# EAGLE design PPR_2_MP (EAGLE 6.4)

## Sheet 1 of 10
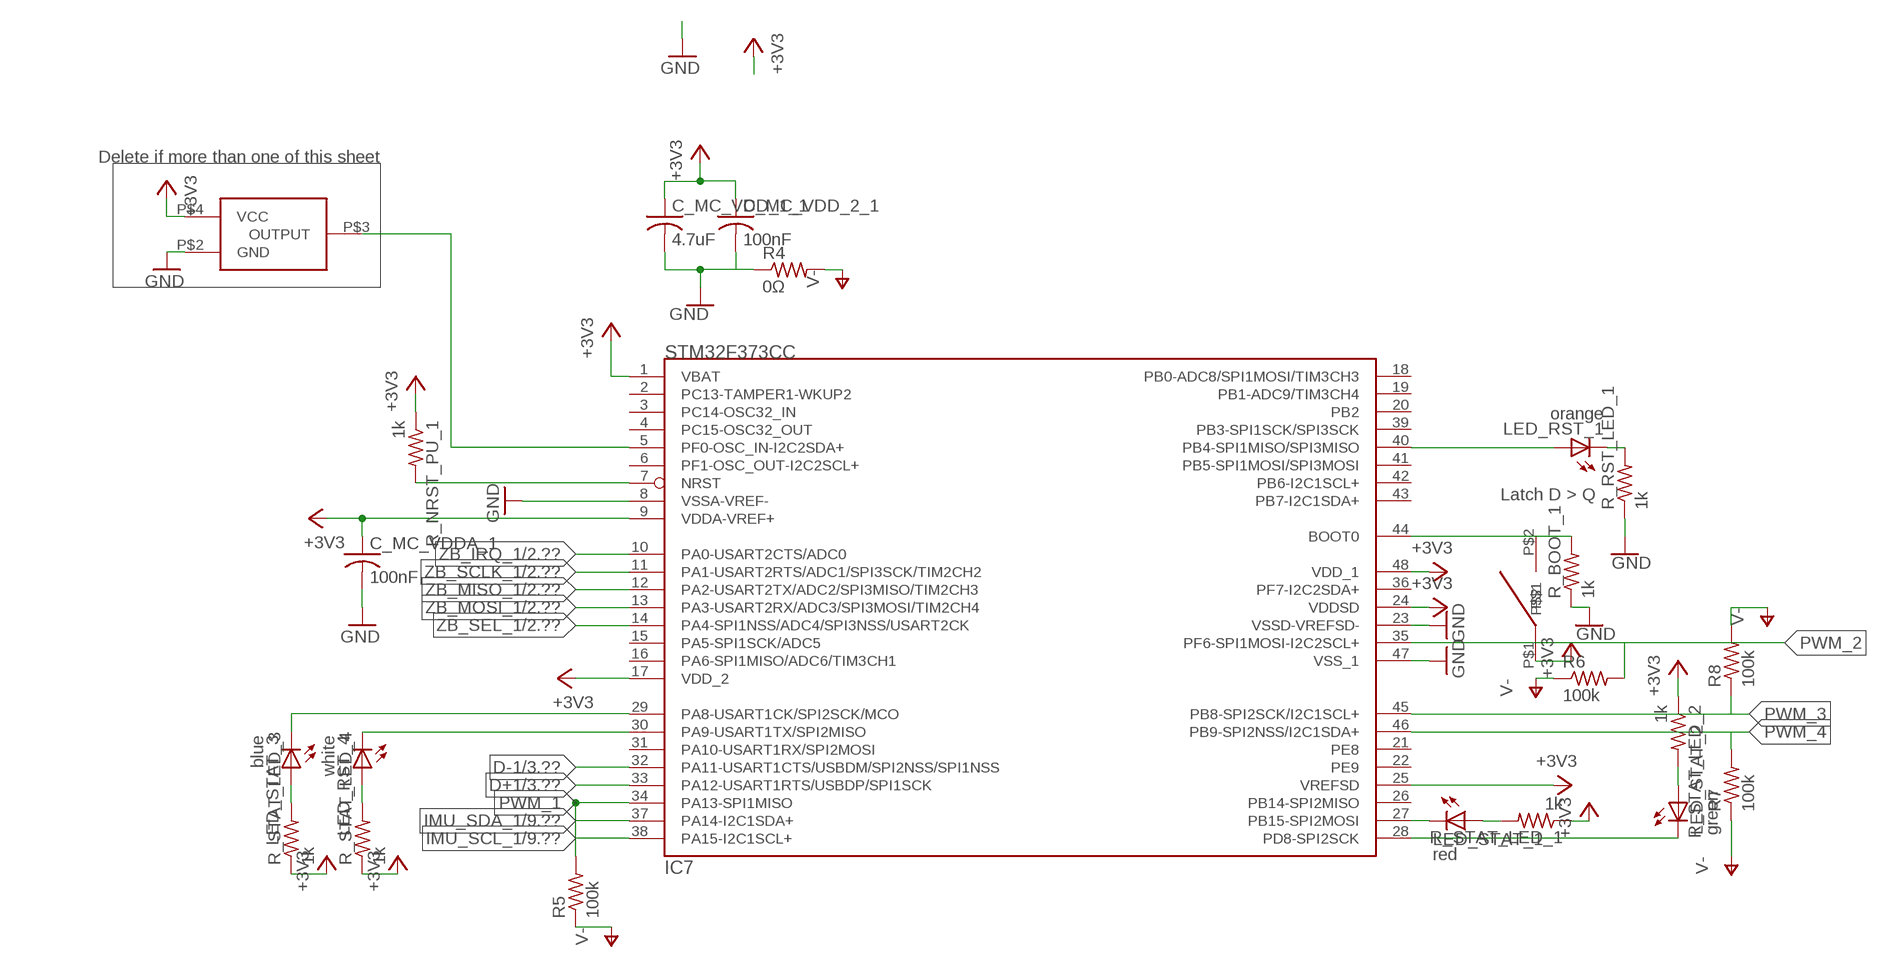
[diagram p0: schematic, sheet 1]

### Parts
C_MC_VDD_1_1  4.7uF  C-USC0603  [C0603]
C_MC_VDD_2_1  100nF  C-USC0603  [C0603]
C_MC_VDDA_1  100nF  C-USC0603  [C0603]
IC7  STM32F373CC  [LQFP48]
LED_RST_1  orange  LEDCHIPLED_0603  [CHIPLED_0603]
LED_RST_4  white  LEDCHIPLED_0603  [CHIPLED_0603]
LED_STAT_1  red  LEDCHIPLED_0603  [CHIPLED_0603]
LED_STAT_2  green  LEDCHIPLED_0603  [CHIPLED_0603]
LED_STAT_3  blue  LEDCHIPLED_0603  [CHIPLED_0603]
OSC1  FOX924B  [4-SMD_5X3.2]
R4  0Ω  R-US_R0603  [R0603]
R5  100k  R-US_R0603  [R0603]
R6  100k  R-US_R0603  [R0603]
R7  100k  R-US_R0603  [R0603]
R8  100k  R-US_R0603  [R0603]
R_BOOT_1  1k  R-US_R0603  [R0603]
R_NRST_PU_1  1k  R-US_R0603  [R0603]
R_RST_LED_1  1k  R-US_R0603  [R0603]
R_STAT_LED_1  1k  R-US_R0603  [R0603]
R_STAT_LED_2  1k  R-US_R0603  [R0603]
R_STAT_LED_3  1k  R-US_R0603  [R0603]
R_STAT_LED_4  1k  R-US_R0603  [R0603]
SW1  B3U  [B3U]

### Nets
16MHZ_3V3: IC7.5(PF0-OSC_IN-I2C2SDA+) OSC1.P$3(OUTPUT) ; also sheet 2
+3V3: C_MC_VDD_1_1.1 C_MC_VDD_2_1.1 C_MC_VDDA_1.1 IC7.1(VBAT) IC7.9(VDDA-VREF+) IC7.17(VDD_2) IC7.24(VDDSD) IC7.25(VREFSD) IC7.48(VDD_1) OSC1.P$4(VCC) R_NRST_PU_1.1 R_STAT_LED_1.1 R_STAT_LED_2.1 R_STAT_LED_3.1 R_STAT_LED_4.1 SW1.P$1 ; also sheet 2,8,9
BOOT0_1: IC7.44(BOOT0) R_BOOT_1.2 SW1.P$2
D+1: IC7.33(PA12-USART1RTS/USBDP/SPI1SCK) ; also sheet 3
D-1: IC7.32(PA11-USART1CTS/USBDM/SPI2NSS/SPI1NSS) ; also sheet 3
GND: C_MC_VDD_1_1.2 C_MC_VDD_2_1.2 C_MC_VDDA_1.2 IC7.8(VSSA-VREF-) IC7.23(VSSD-VREFSD-) IC7.47(VSS_1) OSC1.P$2(GND) R4.1 R_BOOT_1.1 R_RST_LED_1.1 ; also sheet 2,3,8,9,10
IMU_SCL_1: IC7.38(PA15-I2C1SCL+) ; also sheet 9
IMU_SDA_1: IC7.37(PA14-I2C1SDA+) ; also sheet 9
LED_RST_1_1: IC7.40(PB4-SPI1MISO/SPI3MISO) LED_RST_1.A
LED_RST_2_1: LED_RST_1.C R_RST_LED_1.2
N$1: IC7.27(PB15-SPI2MOSI) LED_STAT_1.C
N$2: LED_STAT_1.A R_STAT_LED_1.2
N$3: LED_STAT_2.A R_STAT_LED_2.2
N$4: IC7.28(PD8-SPI2SCK) LED_STAT_2.C
N$5: LED_STAT_3.A R_STAT_LED_3.2
N$6: LED_RST_4.A R_STAT_LED_4.2
N$7: IC7.30(PA9-USART1TX/SPI2MISO) LED_RST_4.C
N$8: IC7.29(PA8-USART1CK/SPI2SCK/MCO) LED_STAT_3.C
NRST_1: IC7.7(NRST) R_NRST_PU_1.2
PWM_1: IC7.34(PA13-SPI1MISO) R5.2 ; also sheet 4
PWM_2: IC7.35(PF6-SPI1MOSI-I2C2SCL+) R6.2 ; also sheet 5
PWM_3: IC7.45(PB8-SPI2SCK/I2C1SCL+) R8.1 ; also sheet 6
PWM_4: IC7.46(PB9-SPI2NSS/I2C1SDA+) R7.2 ; also sheet 7
V-: R4.2 R5.1 R6.1 R7.1 R8.2 ; also sheet 4,5,6,7
ZB_IRQ_1: IC7.10(PA0-USART2CTS/ADC0) ; also sheet 2
ZB_MISO_1: IC7.12(PA2-USART2TX/ADC2/SPI3MISO/TIM2CH3) ; also sheet 2
ZB_MOSI_1: IC7.13(PA3-USART2RX/ADC3/SPI3MOSI/TIM2CH4) ; also sheet 2
ZB_SCLK_1: IC7.11(PA1-USART2RTS/ADC1/SPI3SCK/TIM2CH2) ; also sheet 2
ZB_SEL_1: IC7.14(PA4-SPI1NSS/ADC4/SPI3NSS/USART2CK) ; also sheet 2
Unconnected: IC7.2(PC13-TAMPER1-WKUP2) IC7.3(PC14-OSC32_IN) IC7.4(PC15-OSC32_OUT) IC7.6(PF1-OSC_OUT-I2C2SCL+) IC7.15(PA5-SPI1SCK/ADC5) IC7.16(PA6-SPI1MISO/ADC6/TIM3CH1) IC7.18(PB0-ADC8/SPI1MOSI/TIM3CH3) IC7.19(PB1-ADC9/TIM3CH4) IC7.20(PB2) IC7.21(PE8) IC7.22(PE9) IC7.26(PB14-SPI2MISO) IC7.31(PA10-USART1RX/SPI2MOSI) IC7.36(PF7-I2C2SDA+) IC7.39(PB3-SPI1SCK/SPI3SCK) IC7.41(PB5-SPI1MOSI/SPI3MOSI) IC7.42(PB6-I2C1SCL+) IC7.43(PB7-I2C1SDA+)

### Notes on the sheet
- Delete if more than one of this sheet
- Latch D > Q

## Sheet 2 of 10
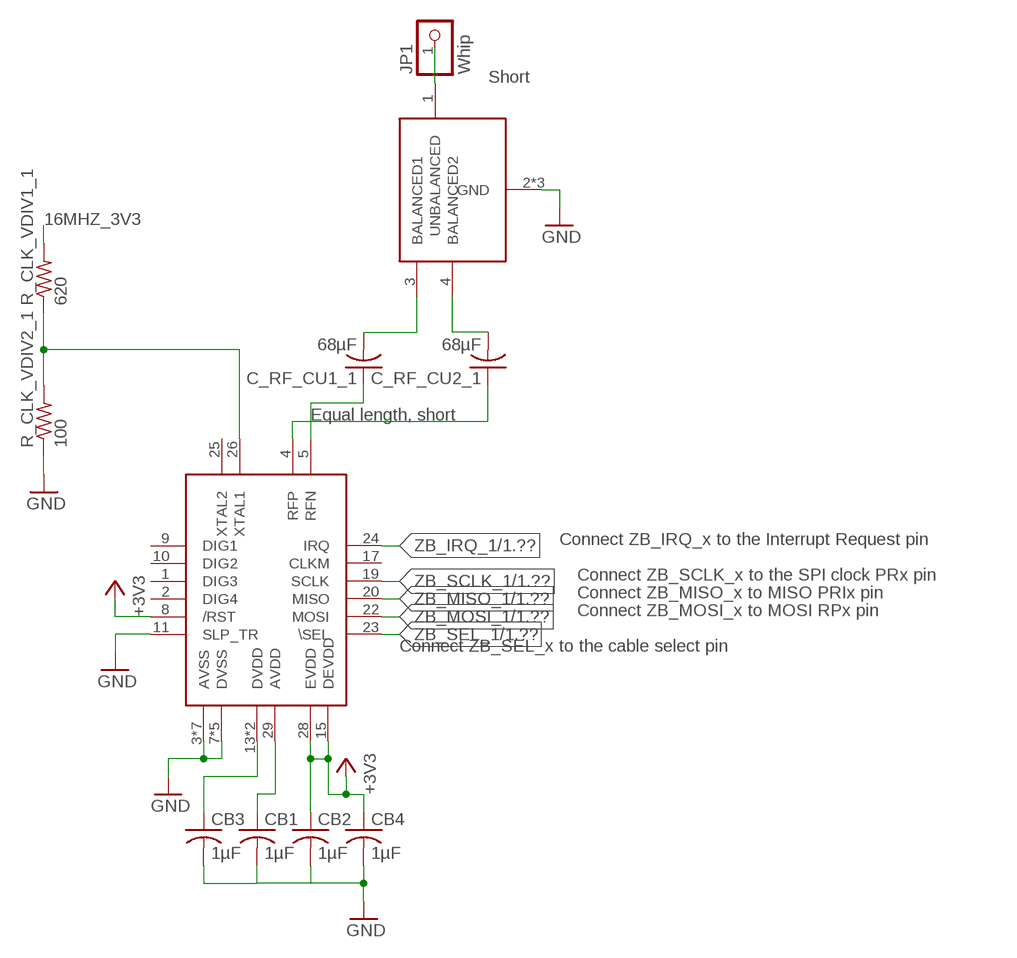
[diagram p1: schematic, sheet 2]

### Parts
BALUN1  0896FB15A0100  [0896FB15A0100]
C_RF_CU1_1  68µF  C-USC0603  [C0603]
C_RF_CU2_1  68µF  C-USC0603  [C0603]
CB1  1µF  C-USC0603  [C0603]
CB2  1µF  C-USC0603  [C0603]
CB3  1µF  C-USC0603  [C0603]
CB4  1µF  C-USC0603  [C0603]
JP1  Whip  PINHD-1X01_2.00  [1X01M]
R_CLK_VDIV1_1  620  R-US_R0603  [R0603]
R_CLK_VDIV2_1  100  R-US_R0603  [R0603]
RADIO1  AT86RF  [QFNN32]

### Nets
16MHZ_0V5_AC1: R_CLK_VDIV1_1.1 R_CLK_VDIV2_1.2 RADIO1.26(XTAL1)
16MHZ_3V3: R_CLK_VDIV1_1.2 ; also sheet 1
+3V3: CB2.1 CB4.1 RADIO1.8(/RST) RADIO1.15(DEVDD) RADIO1.28(EVDD) ; also sheet 1,8,9
ANT1: BALUN1.1(UNBALANCED) JP1.1
GND: BALUN1.2(GND) BALUN1.5(GND) BALUN1.6(GND) CB1.2 CB2.2 CB3.2 CB4.2 R_CLK_VDIV2_1.1 RADIO1.3(AVSS) RADIO1.6(AVSS) RADIO1.7(DVSS) RADIO1.11(SLP_TR) RADIO1.12(DVSS) RADIO1.16(DVSS) RADIO1.18(DVSS) RADIO1.21(DVSS) RADIO1.27(AVSS) RADIO1.30(AVSS) RADIO1.31(AVSS) RADIO1.32(AVSS) RADIO1.EXP(AVSS) ; also sheet 1,3,8,9,10
ZB_AVDD1: CB1.1 RADIO1.29(AVDD)
ZB_BAL1_1: BALUN1.3(BALANCED1) C_RF_CU1_1.2
ZB_BAL2_1: BALUN1.4(BALANCED2) C_RF_CU2_1.2
ZB_DVDD1: CB3.1 RADIO1.13(DVDD) RADIO1.14(DVDD)
ZB_IRQ_1: RADIO1.24(IRQ) ; also sheet 1
ZB_MISO_1: RADIO1.20(MISO) ; also sheet 1
ZB_MOSI_1: RADIO1.22(MOSI) ; also sheet 1
ZB_RFN1: C_RF_CU2_1.1 RADIO1.4(RFP)
ZB_RFP1: C_RF_CU1_1.1 RADIO1.5(RFN)
ZB_SCLK_1: RADIO1.19(SCLK) ; also sheet 1
ZB_SEL_1: RADIO1.23(\SEL) ; also sheet 1
Unconnected: RADIO1.1(DIG3) RADIO1.2(DIG4) RADIO1.9(DIG1) RADIO1.10(DIG2) RADIO1.17(CLKM) RADIO1.25(XTAL2)

### Notes on the sheet
- Short
- Equal length, short
- Connect ZB_IRQ_x to the Interrupt Request pin
- Connect ZB_SCLK_x to the SPI clock PRx pin
- Connect ZB_MISO_x to MISO PRIx pin
- Connect ZB_MOSI_x to MOSI RPx pin
- Connect ZB_SEL_x to the cable select pin

## Sheet 3 of 10
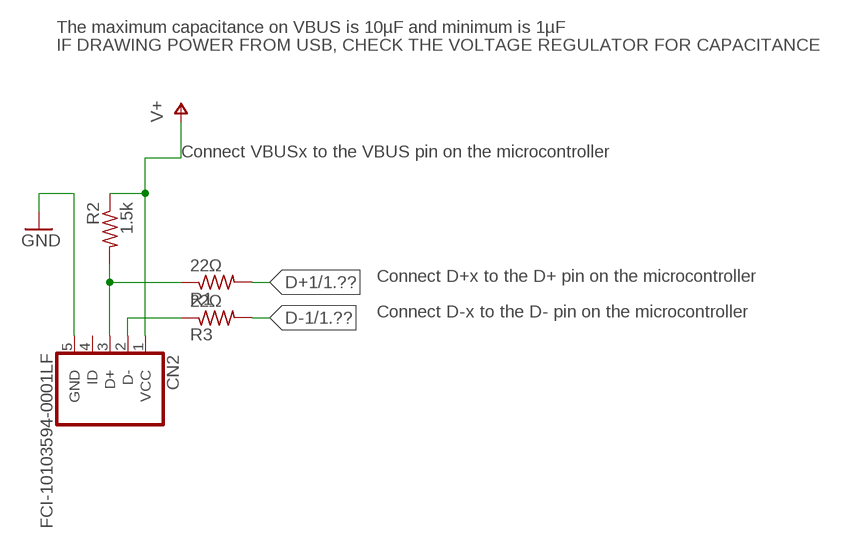
[diagram p2: schematic, sheet 3]

### Parts
CN2  FCI-10103594-0001LF  USB-RECEPTABLE  [FCI-10103594-0001LF]
R1  22Ω  R-US_R0402  [R0402]
R2  1.5k  R-US_R0402  [R0402]
R3  22Ω  R-US_R0402  [R0402]

### Nets
D+1: R1.2 ; also sheet 1
D+_IN_1: CN2.3(D+) R1.1 R2.2
D-1: R3.2 ; also sheet 1
D-_IN_1: CN2.2(D-) R3.1
GND: CN2.5(GND) ; also sheet 1,2,8,9,10
V+: CN2.1(VCC) R2.1 ; also sheet 4,5,6,7,8,10
Unconnected: CN2.4(ID)

### Notes on the sheet
- The maximum capacitance on VBUS is 10µF and minimum is 1µF
- IF DRAWING POWER FROM USB, CHECK THE VOLTAGE REGULATOR FOR CAPACITANCE
- Connect VBUSx to the VBUS pin on the microcontroller
- Connect D+x to the D+ pin on the microcontroller
- Connect D-x to the D- pin on the microcontroller

## Sheet 4 of 10
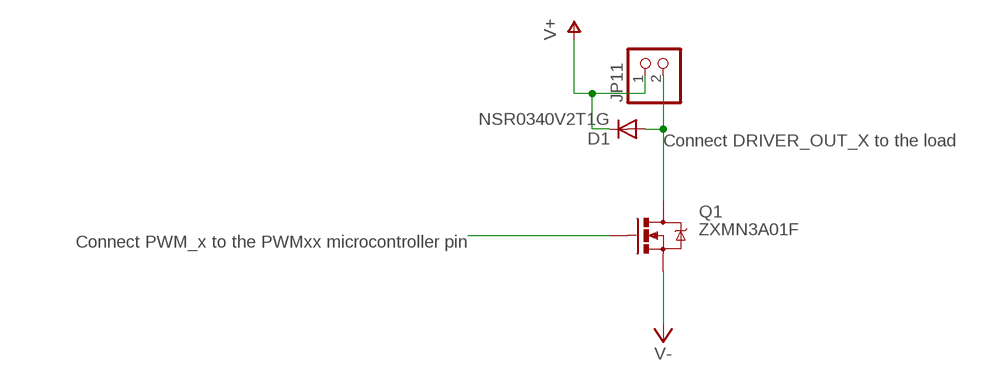
[diagram p3: schematic, sheet 4]

### Parts
D1  NSR0340V2T1G  DIODE-SOD523  [SOD523]
JP11  PINHD-1X2  [1X02]
Q1  ZXMN3A01F  MOSFET-NCHANNELSMD  [SOT23-3]

### Nets
DRIVER_OUT_1: D1.A JP11.2 Q1.3(D)
PWM_1: Q1.1(G) ; also sheet 1
V+: D1.C JP11.1 ; also sheet 3,5,6,7,8,10
V-: Q1.2(S) ; also sheet 1,5,6,7

### Notes on the sheet
- Connect DRIVER_OUT_X to the load
- Connect PWM_x to the PWMxx microcontroller pin

## Sheet 5 of 10
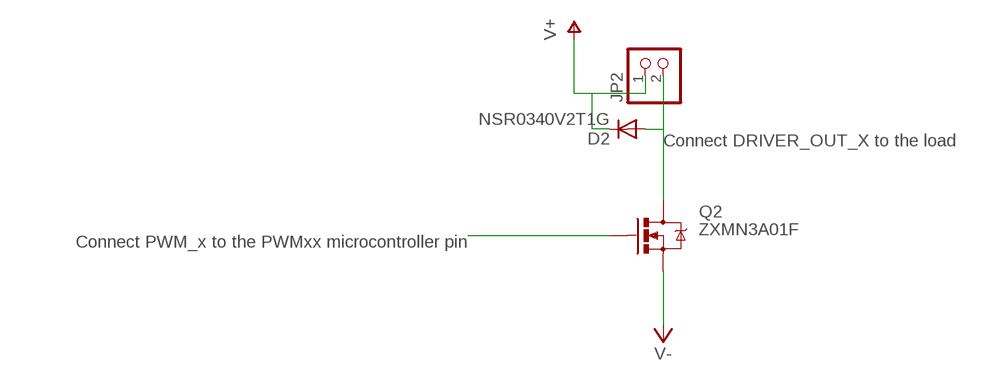
[diagram p4: schematic, sheet 5]

### Parts
D2  NSR0340V2T1G  DIODE-SOD523  [SOD523]
JP2  PINHD-1X2  [1X02]
Q2  ZXMN3A01F  MOSFET-NCHANNELSMD  [SOT23-3]

### Nets
DRIVER_OUT_2: D2.A JP2.2 Q2.3(D)
PWM_2: Q2.1(G) ; also sheet 1
V+: D2.C JP2.1 ; also sheet 3,4,6,7,8,10
V-: Q2.2(S) ; also sheet 1,4,6,7

### Notes on the sheet
- Connect DRIVER_OUT_X to the load
- Connect PWM_x to the PWMxx microcontroller pin

## Sheet 6 of 10
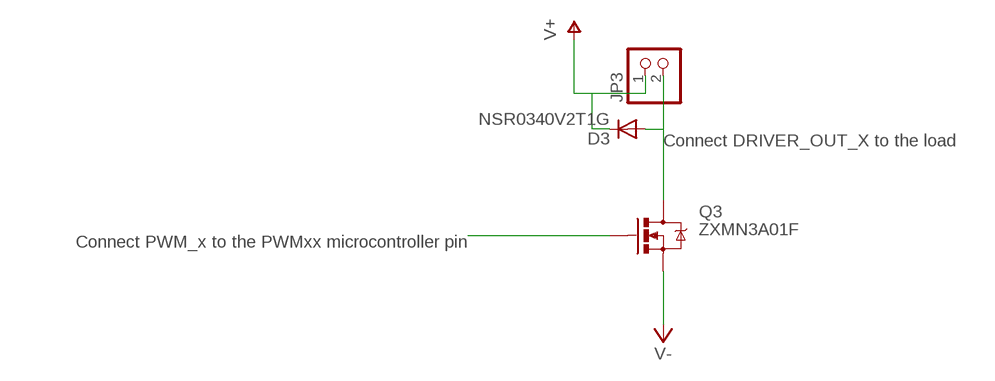
[diagram p5: schematic, sheet 6]

### Parts
D3  NSR0340V2T1G  DIODE-SOD523  [SOD523]
JP3  PINHD-1X2  [1X02]
Q3  ZXMN3A01F  MOSFET-NCHANNELSMD  [SOT23-3]

### Nets
DRIVER_OUT_3: D3.A JP3.2 Q3.3(D)
PWM_3: Q3.1(G) ; also sheet 1
V+: D3.C JP3.1 ; also sheet 3,4,5,7,8,10
V-: Q3.2(S) ; also sheet 1,4,5,7

### Notes on the sheet
- Connect DRIVER_OUT_X to the load
- Connect PWM_x to the PWMxx microcontroller pin

## Sheet 7 of 10
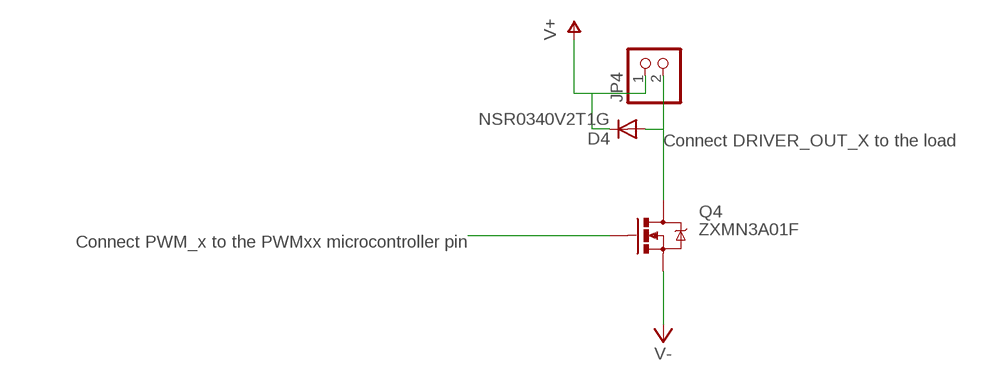
[diagram p6: schematic, sheet 7]

### Parts
D4  NSR0340V2T1G  DIODE-SOD523  [SOD523]
JP4  PINHD-1X2  [1X02]
Q4  ZXMN3A01F  MOSFET-NCHANNELSMD  [SOT23-3]

### Nets
DRIVER_OUT_4: D4.A JP4.2 Q4.3(D)
PWM_4: Q4.1(G) ; also sheet 1
V+: D4.C JP4.1 ; also sheet 3,4,5,6,8,10
V-: Q4.2(S) ; also sheet 1,4,5,6

### Notes on the sheet
- Connect DRIVER_OUT_X to the load
- Connect PWM_x to the PWMxx microcontroller pin

## Sheet 8 of 10
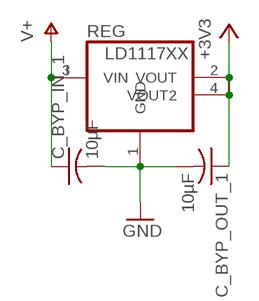
[diagram p7: schematic, sheet 8]

### Parts
C_BYP_IN_1  10µF  C-USC1206  [C1206]
C_BYP_OUT_1  10µF  C-USC0603  [C0603]
REG  LD1117XX  [SOT-223]

### Nets
+3V3: C_BYP_OUT_1.1 REG.2(VOUT) REG.4(VOUT2) ; also sheet 1,2,9
GND: C_BYP_IN_1.2 C_BYP_OUT_1.2 REG.1(GND) ; also sheet 1,2,3,9,10
V+: C_BYP_IN_1.1 REG.3(VIN) ; also sheet 3,4,5,6,7,10

## Sheet 9 of 10
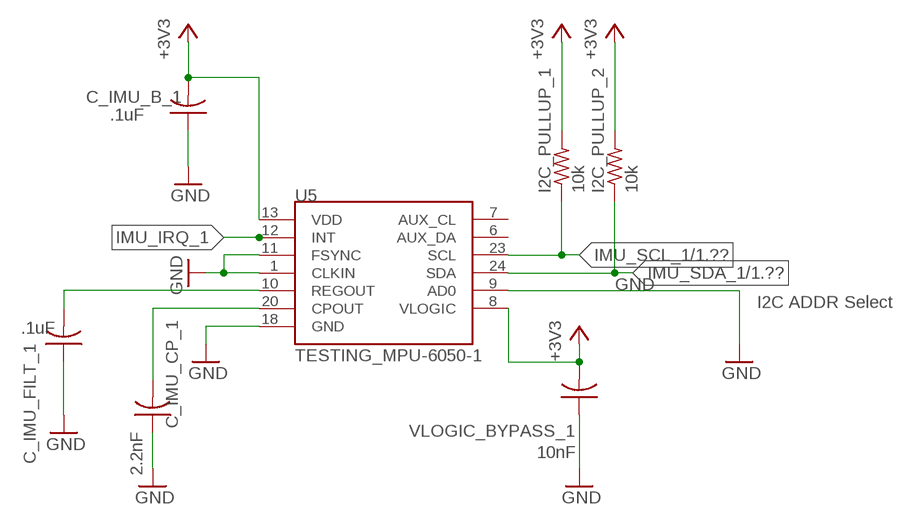
[diagram p8: schematic, sheet 9]

### Parts
C_IMU_B_1  .1uF  C-USC0603  [C0603]
C_IMU_CP_1  2.2nF  C-USC0603  [C0603]
C_IMU_FILT_1  .1uF  C-USC0603  [C0603]
I2C_PULLUP_1  10k  R-US_R0402  [R0402]
I2C_PULLUP_2  10k  R-US_R0402  [R0402]
U5  TESTING_MPU-6050-1  [TESTING_QFN-24-4MM2]
VLOGIC_BYPASS_1  10nF  C-USC0603  [C0603]

### Nets
+3V3: C_IMU_B_1.2 I2C_PULLUP_1.2 I2C_PULLUP_2.2 U5.8(VLOGIC) U5.13(VDD) VLOGIC_BYPASS_1.2 ; also sheet 1,2,8
CPOUT_1: C_IMU_CP_1.2 U5.20(CPOUT)
GND: C_IMU_B_1.1 C_IMU_CP_1.1 C_IMU_FILT_1.1 U5.1(CLKIN) U5.9(AD0) U5.11(FSYNC) U5.18(GND) VLOGIC_BYPASS_1.1 ; also sheet 1,2,3,8,10
IMU_IRQ_1: U5.12(INT)
IMU_SCL_1: I2C_PULLUP_1.1 U5.23(SCL) ; also sheet 1
IMU_SDA_1: I2C_PULLUP_2.1 U5.24(SDA) ; also sheet 1
REGOUT_1: C_IMU_FILT_1.2 U5.10(REGOUT)
Unconnected: U5.6(AUX_DA) U5.7(AUX_CL)

### Notes on the sheet
- I2C ADDR Select

## Sheet 10 of 10
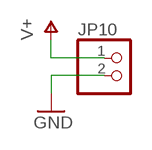
[diagram p9: schematic, sheet 10]

### Parts
JP10  PINHD-1X2  [1X02]

### Nets
GND: JP10.2 ; also sheet 1,2,3,8,9
V+: JP10.1 ; also sheet 3,4,5,6,7,8

## Library data of the parts
BALUN1 = piccoli:0896FB15A0100
C_BYP_IN_1 C_BYP_OUT_1 C_IMU_B_1 C_IMU_CP_1 C_IMU_FILT_1 C_MC_VDD_1_1 C_MC_VDD_2_1 C_MC_VDDA_1 C_RF_CU1_1 C_RF_CU2_1 CB1-CB4 VLOGIC_BYPASS_1 = resistor:C-US: CAPACITOR, American symbol
CN2 = neels:USB-RECEPTABLE: USB Receptable
D1-D4 = diode:DIODE-: DIODE
I2C_PULLUP_1 I2C_PULLUP_2 = rcl:R-US_: RESISTOR, American symbol
IC7 = neels:STM32F373CC
JP1 = pinhead-2:PINHD-1X01: PIN HEADER
JP2-JP4 JP10 JP11 = pinhead:PINHD-1X2: PIN HEADER
LED_RST_1 LED_RST_4 LED_STAT_1-LED_STAT_3 = led:LED: LED OSRAM: - CHIPLED LG R971, LG N971, LY N971, LG Q971, LY Q971, LO R971, LY R971 LH N974, LH R974 LS Q976, LO Q976, LY Q976 LO Q996 - Hyper CHIPLED LW Q18S LB Q993, LB Q99A, LB R99A - SideLED LS A670, LO A670, LY A670, LG A670, LP A670 LB A673, LV A673, LT A673, LW A673 LH A674 LY A675 LS A676, LA A676, LO A676, LY A676, LW A676 LS A679, LY A679, LG A679 - Hyper Micro SIDELED® LS Y876, LA Y876, LO Y876, LY Y876 LT Y87S - SmartLED LW L88C, LW L88S LB L89C, LB L89S, LG L890 LS L89K, LO L89K, LY L89K LS L896, LA L896, LO L896, LY L896 - TOPLED LS T670, LO T670, LY T670, LG T670, LP T670 LSG T670, LSP T670, LSY T670, LOP T670, LYG T670 LG T671, LOG T671, LSG T671 LB T673, LV T673, LT T673, LW T673 LH T674 LS T676, LA T676, LO T676, LY T676, LB T676, LH T676, LSB T676, LW T676 LB T67C, LV T67C, LT T67C, LS T67K, LO T67K, LY T67K, LW E67C LS E67B, LA E67B, LO E67B, LY E67B, LB E67C, LV E67C, LT E67C LW T67C LS T679, LY T679, LG T679 LS T770, LO T770, LY T770, LG T770, LP T770 LB T773, LV T773, LT T773, LW T773 LH T774 LS E675, LA E675, LY E675, LS T675 LS T776, LA T776, LO T776, LY T776, LB T776 LHGB T686 LT T68C, LB T68C - Hyper Mini TOPLED® LB M676 - Mini TOPLED Santana® LG M470 LS M47K, LO M47K, LY M47K Source: http://www.osram.convergy.de LUXEON: - LUMILED® LXK2-PW12-R00, LXK2-PW12-S00, LXK2-PW14-U00, LXK2-PW14-V00 LXK2-PM12-R00, LXK2-PM12-S00, LXK2-PM14-U00 LXK2-PE12-Q00, LXK2-PE12-R00, LXK2-PE12-S00, LXK2-PE14-T00, LXK2-PE14-U00 LXK2-PB12-K00, LXK2-PB12-L00, LXK2-PB12-M00, LXK2-PB14-N00, LXK2-PB14-P00, LXK2-PB14-Q00 LXK2-PR12-L00, LXK2-PR12-M00, LXK2-PR14-Q00, LXK2-PR14-R00 LXK2-PD12-Q00, LXK2-PD12-R00, LXK2-PD12-S00 LXK2-PH12-R00, LXK2-PH12-S00 LXK2-PL12-P00, LXK2-PL12-Q00, LXK2-PL12-R00 Source: www.luxeon.com KINGBRIGHT: KA-3528ASYC Source: www.kingbright.com
OSC1 = piccoli:FOX924B
Q1-Q4 = SparkFun-DiscreteSemi:MOSFET-NCHANNEL: Generic NMOS footprint
R1-R8 R_BOOT_1 R_CLK_VDIV1_1 R_CLK_VDIV2_1 R_NRST_PU_1 R_RST_LED_1 R_STAT_LED_1-R_STAT_LED_4 = resistor:R-US_: RESISTOR, American symbol
RADIO1 = piccoli:AT86RF
REG = piccoli:LD1117XX
SW1 = zz-upenn:B3U
U5 = MPU-6050:TESTING_MPU-6050: MPU-6050 6DOF IMU

## Board
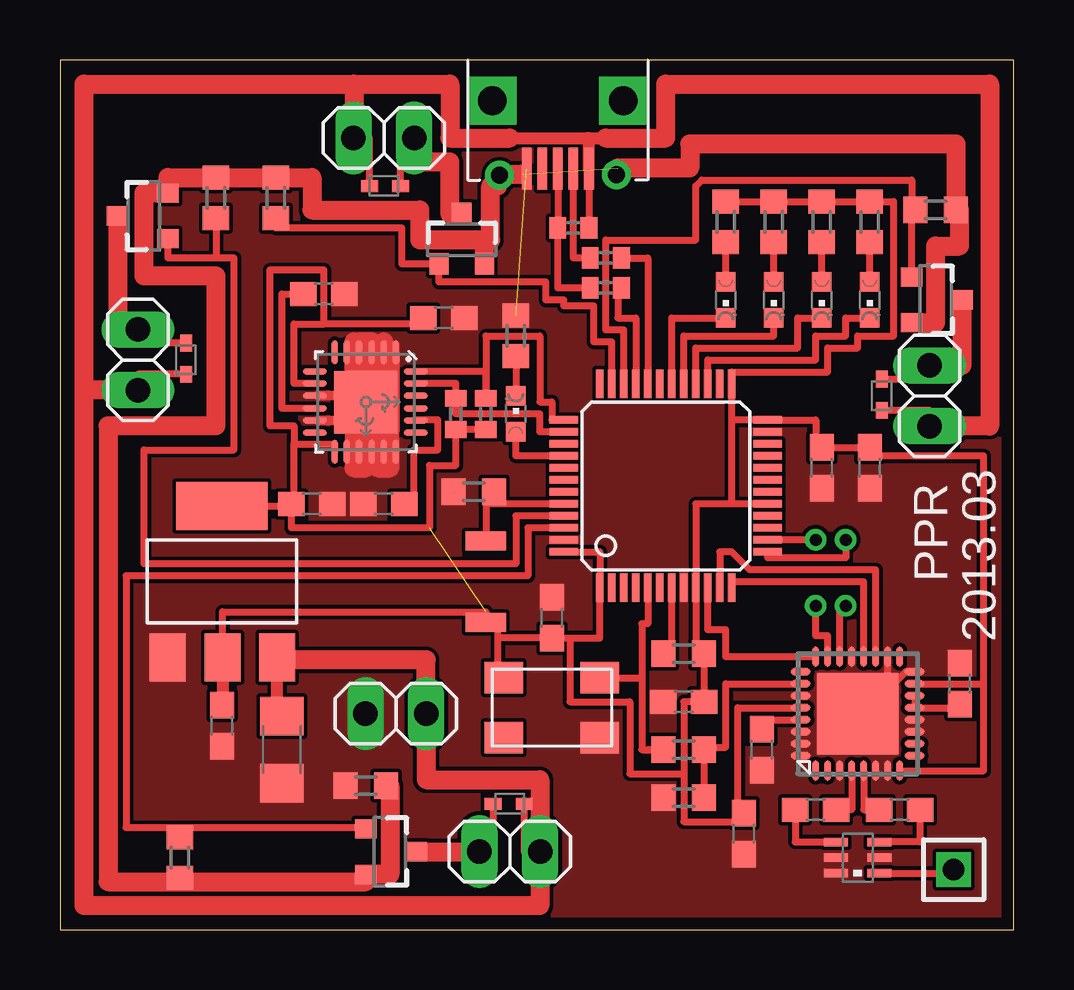
[diagram p10: board, top side]
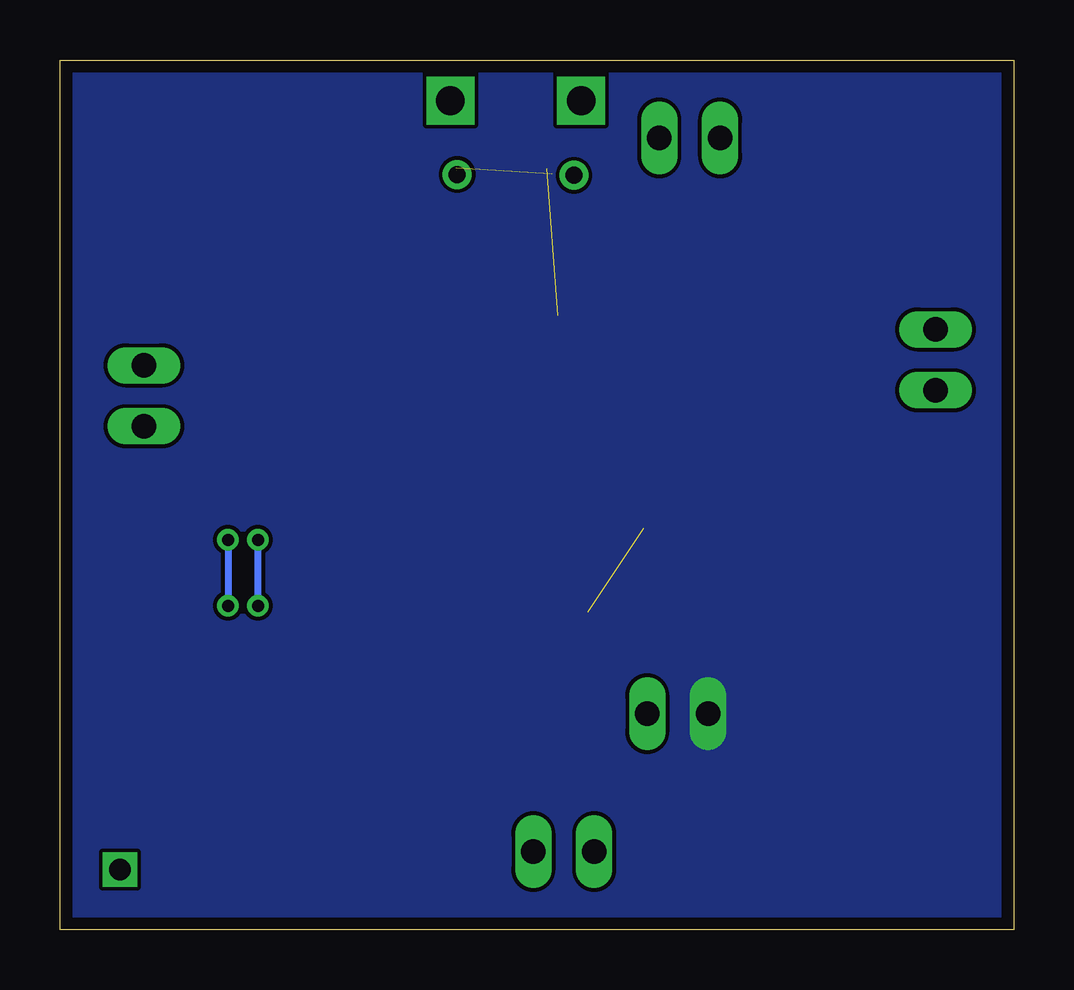
[diagram p11: board, bottom side, seen from below]

Size 39.75 x 36.25 mm. Coordinates in mm from the lower left corner, seen from the top.
Outline: 0,0 39.75,0 39.75,36.25 0,36.25 0,0
Copper layers (1*16): Top 0.035mm / dielectric 1.5mm / Bottom 0.035mm
Design rules "4pcb 33 each": minimum track width 6mil, minimum drill 15mil, track to track 6mil, track to pad 6mil, pad to pad 6mil, via to via 6mil, smd to smd 3mil, copper to edge 20mil, drill to drill 8mil, minimum pad ring 10mil, minimum via ring 8mil, stop-mask expansion 4mil, vias tented up to drill 0mil, thermal gap 10mil

### Footprints (pad centres in the part's own frame; a part is rotated, then mirrored left to right if it is on the bottom)
0896FB15A0100 = smd 0.35 x 1: 1 -0.65,-0.9; 2 0,-0.9; 3 0.65,-0.9; 4 0.65,0.9; 5 0,0.9; 6 -0.65,0.9
C1206 = smd 1.6 x 1.8: 1 -1.4,0; 2 1.4,0
C0603 = smd 1.1 x 1: 1 -0.85,0; 2 0.85,0
FCI-10103594-0001LF = smd 0.4 x 1.75: 1 -1.3,4.525; 2 -0.65,4.525; 3 0,4.525; 4 0.65,4.525; 5 1.3,4.525 | drill 0.7: P$1 -2.443,4.776; P$2 2.428,4.806 | drill 1.2 pad 2 square: P$3 -2.725,1.7; P$4 2.725,1.7
SOD523 = smd 0.7 x 0.5: A 0.7,0; C -0.6,0
R0402 = smd 0.7 x 0.9: 1 -0.65,0; 2 0.65,0
LQFP48 = smd 0.3 x 1.2: 1 -2.75,-4.25; 2 -2.25,-4.25; 3 -1.75,-4.25; 4 -1.25,-4.25; 5 -0.75,-4.25; 6 -0.25,-4.25; 7 0.25,-4.25; 8 0.75,-4.25; 9 1.25,-4.25; 10 1.75,-4.25; 11 2.25,-4.25; 12 2.75,-4.25; 25 2.75,4.25; 26 2.25,4.25; 27 1.75,4.25; 28 1.25,4.25; 29 0.75,4.25; 30 0.25,4.25; 31 -0.25,4.25; 32 -0.75,4.25; 33 -1.25,4.25; 34 -1.75,4.25; 35 -2.25,4.25; 36 -2.75,4.25 | smd 1.2 x 0.3: 13 4.25,-2.75; 14 4.25,-2.25; 15 4.25,-1.75; 16 4.25,-1.25; 17 4.25,-0.75; 18 4.25,-0.25; 19 4.25,0.25; 20 4.25,0.75; 21 4.25,1.25; 22 4.25,1.75; 23 4.25,2.25; 24 4.25,2.75; 37 -4.25,2.75; 38 -4.25,2.25; 39 -4.25,1.75; 40 -4.25,1.25; 41 -4.25,0.75; 42 -4.25,0.25; 43 -4.25,-0.25; 44 -4.25,-0.75; 45 -4.25,-1.25; 46 -4.25,-1.75; 47 -4.25,-2.25; 48 -4.25,-2.75
1X01M = drill 0.914 square: 1 0,0
1X02 = drill 1.016 long: 1 -1.27,0; 2 1.27,0
CHIPLED_0603 = smd 0.8 x 0.8: A 0,-0.75; C 0,0.75
4-SMD_5X3.2 = smd 1.6 x 1.3: P$1 -2,-1.25; P$2 2,-1.25; P$3 2,1.25; P$4 -2,1.25
SOT23-3 = smd 0.8 x 0.9: 1 -0.95,-1; 2 0.95,-1; 3 0,1.1
R0603 = smd 1 x 1.1: 1 -0.85,0; 2 0.85,0
QFNN32 = smd 0.85 x 0.3: 1 -2.375,1.75; 2 -2.375,1.25; 3 -2.375,0.75; 4 -2.375,0.25; 5 -2.375,-0.25; 6 -2.375,-0.75; 7 -2.375,-1.25; 8 -2.375,-1.75; 17 2.375,-1.75; 18 2.375,-1.25; 19 2.375,-0.75; 20 2.375,-0.25; 21 2.375,0.25; 22 2.375,0.75; 23 2.375,1.25; 24 2.375,1.75 | smd 0.3 x 0.85: 9 -1.75,-2.375; 10 -1.25,-2.375; 11 -0.75,-2.375; 12 -0.25,-2.375; 13 0.25,-2.375; 14 0.75,-2.375; 15 1.25,-2.375; 16 1.75,-2.375; 25 1.75,2.375; 26 1.25,2.375; 27 0.75,2.375; 28 0.25,2.375; 29 -0.25,2.375; 30 -0.75,2.375; 31 -1.25,2.375; 32 -1.75,2.375 | smd 3.4 x 3.4: EXP 0,0
SOT-223 = smd 1.499 x 2.007: 1 -2.261,-3.15; 2 0.025,-3.15; 3 2.311,-3.15 | smd 3.81 x 2.007: 4 0,3.15
B3U = smd 0.8 x 1.7: P$1 -1.7,0; P$2 1.7,0
TESTING_QFN-24-4MM2 = smd 1.016 x 0.254: 1 -2.066,1.257; 2 -2.066,0.75; 3 -2.066,0.247; 4 -2.066,-0.287; 5 -2.066,-0.792; 6 -2.066,-1.297; 13 2.086,-1.297; 14 2.086,-0.792; 15 2.086,-0.287; 16 2.086,0.247; 17 2.086,0.75; 18 2.086,1.257 | smd 0.254 x 1.016: 7 -1.267,-2.122; 8 -0.762,-2.122; 9 -0.258,-2.122; 10 0.278,-2.122; 11 0.78,-2.122; 12 1.287,-2.122; 19 1.287,2.082; 20 0.78,2.082; 21 0.278,2.082; 22 -0.258,2.082; 23 -0.762,2.082; 24 -1.267,2.082 | smd 2.616 x 2.616: P$1 0.02,-0.01

### Placement (x,y rotation side)
BALUN1  33.25,3 90 top
C_BYP_IN_1  9.25,7.5 270 top
C_BYP_OUT_1  6.75,8.5 270 top
C_IMU_B_1  10.5,17.75 180 top
C_IMU_CP_1  13.5,17.75 0 top
C_IMU_FILT_1  11,26.5 180 top
C_MC_VDD_1_1  20.5,13 90 top
C_MC_VDD_2_1  31.75,19.25 270 top
C_MC_VDDA_1  26,9.5 180 top
C_RF_CU1_1  35,5 0 top
C_RF_CU2_1  31.5,5 180 top
CB1  29.25,7.5 270 top
CB2  28.5,4 270 top
CB3  37.5,10.25 90 top
CB4  33.75,19.25 270 top
CN2  20.75,36.25 180 top
D1  34.25,22.25 90 top
D2  13.5,31 0 top
D3  5.25,23.75 90 top
D4  18.75,5.25 180 top
I2C_PULLUP_1  16.5,21.5 270 top
I2C_PULLUP_2  17.75,21.5 270 top
IC7  25.25,18.5 0 top
JP1  37.25,2.5 90 top
JP2  13.5,33 0 top
JP3  3.25,23.75 90 top
JP4  18.75,3.25 180 top
JP10  14,9 180 top
JP11  36.25,22.25 90 top
LED_RST_1  19,21.5 0 top
LED_RST_4  27.75,26.25 180 top
LED_STAT_1  33.75,26.25 180 top
LED_STAT_2  31.75,26.25 180 top
LED_STAT_3  29.75,26.25 180 top
OSC1  20.5,9.25 0 top
Q1  36.5,26.25 270 top
Q2  16.75,28.75 0 top
Q3  3.5,29.75 90 top
Q4  13.75,3.25 270 top
R1  22.75,26.75 0 top
R2  21.4,29.25 180 top
R3  22.75,28 0 top
R4  12.75,6 0 top
R5  36.5,30 180 top
R6  9,30.5 270 top
R7  5,3 90 top
R8  6.5,30.5 90 top
R_BOOT_1  17.25,18.25 0 top
R_CLK_VDIV1_1  26,7.5 180 top
R_CLK_VDIV2_1  26,5.5 0 top
R_NRST_PU_1  26,11.5 180 top
R_RST_LED_1  19,24.75 270 top
R_STAT_LED_1  33.75,29.5 270 top
R_STAT_LED_2  31.75,29.5 270 top
R_STAT_LED_3  29.75,29.5 270 top
R_STAT_LED_4  27.75,29.5 270 top
RADIO1  33.25,9 90 top
REG  6.75,14.5 0 top
SW1  17.75,14.5 90 top
U5  12.75,22 270 top
VLOGIC_BYPASS_1  16,25.5 180 top

### Tracks (layer width: path | path; a pad name or v marks a point on that pad's centre or on a via)
16MHZ_0V5_AC1
  Top 0.3: R_CLK_VDIV2_1.2 R_CLK_VDIV1_1.1 26.85,7.6 27.75,7.6 27.75,10.25 RADIO1.26
16MHZ_3V3
  Top 0.3: 24.5,7.5 R_CLK_VDIV1_1.2 24.25,7.5 24.25,10.5 | OSC1.P$3 24.25,10.5 | IC7.5 24.5,12.75 24.25,12.75 24.25,10.5
+3V3  (1 unrouted)
  Top 0.3: IC7.48 22.5,15.75 IC7.1 22.5,12.15 21.25,12.15 | 28,21.25 IC7.24 31.5,21.25 31.5,20.5 31.75,20.5 C_MC_VDD_2_1.1 CB4.1 | 28,21.25 IC7.25 28,23.25 32,23.25 32,24.25 33.25,24.25 33.25,24.75 34.75,24.75 34.75,30.35 R_STAT_LED_3.1 | 28,21.25 28,17.75 IC7.17 26.5,17.75 IC7.9 26.5,11.75 R_NRST_PU_1.1 C_MC_VDDA_1.1 26,9.5 26,6.5 | 9.75,20.25 11.45,20.25 U5.13 | OSC1.P$4 18.25,10.5 18.25,12.15 | 18.25,12.15 18.25,12.75 | 18.25,13 18.25,12.75 | 18.25,12.75 17.75,12.75 SW1.P$1 17.75,13.25 6.78,13.25 REG.2 | 18.25,12.15 C_MC_VDD_1_1.1 21.25,12.15 | RADIO1.8 38.5,6.62 38.5,10.25 | CB4.1 33.75,20.25 | I2C_PULLUP_2.2 I2C_PULLUP_1.2 16.5,19.35 15.4,19.35 15.4,16.75 9.65,16.75 C_IMU_B_1.2 | 9.75,17.75 C_IMU_B_1.2 | 9.95,17.75 9.75,17.75 | 9.75,17.75 9.75,20.25 | 9.75,20.25 9.75,21 8.75,21 8.75,27.5 11,27.5 11,25.25 | REG.4 9.65,17.65 C_IMU_B_1.2 | R_STAT_LED_4.1 R_STAT_LED_3.1 | R_STAT_LED_3.1 R_STAT_LED_2.1 R_STAT_LED_1.1 | 11,25.25 15.4,25.25 VLOGIC_BYPASS_1.2 | U5.8 9.75,22.76 9.75,25.25 11,25.25 | 26,6.5 26,4.5 28.25,4.5 28.25,5 | 28.25,5 28.25,9.25 RADIO1.28 | CB2.1 28.5,5 28.25,5 | 21.25,12.15 21.25,9.5 23.75,9.5 23.75,6.5 26,6.5 | RADIO1.15 38.5,10.25 | 38.5,10.25 38.5,19.75 33.75,19.75 CB4.1
  Top 0.5: REG.2 6.78,9.5 C_BYP_OUT_1.1
ANT1
  Top 0.3: BALUN1.1 37.25,2.35 JP1.1
BOOT0_1
  Top 0.3: IC7.44 18,17.75 | 18,17.75 17.75,17.75 SW1.P$2 | R_BOOT_1.2 18,18.25 18,17.75
CPOUT_1
  Top 0.3: C_IMU_CP_1.2 14.75,17.75 14.75,20 15.75,20 15.75,21.25 14.83,21.25 U5.20
D+1
  Top 0.3: IC7.33 24,25.5 23.25,25.5 23.25,26.6 R1.2
D+_IN_1
  Top 0.3: R1.1 20.75,26.75 R2.2 CN2.3
D-1
  Top 0.3: IC7.32 24.5,28 R3.2
D-_IN_1
  Top 0.3: R3.1 21.4,28 CN2.2
DRIVER_OUT_1
  Top 0.3: D1.A 36.25,22.95 JP11.2
  Top 0.8: 37.5,26.25 Q1.3 37.6,23.52 JP11.2
DRIVER_OUT_2
  Top 0.3: D2.A 14.2,33 JP2.2
  Top 0.8: Q2.3 16.25,29.85 16.25,32 14.77,32 JP2.2
DRIVER_OUT_3
  Top 0.3: D3.A 3.25,24.45 JP3.2
  Top 0.8: Q3.3 2.4,25.02 JP3.2
DRIVER_OUT_4
  Top 0.3: D4.A 18.05,3.25 JP4.2
  Top 0.8: Q4.3 JP4.2
GND  (1 unrouted)
  Top 0.3: 13.75,22.26 13.75,21.23 14.01,21.23 | U5.18 14.01,21.23 | 14.01,24 14.01,21.23 | 14.01,21.23 14,21 14,20.75 13.75,20.75 | RADIO1.16 35.25,10.75 34.5,10 RADIO1.18 | 13.5,22.75 13.5,22.26
  Top 0.4: 10.75,22.26 13.5,22.26 13.75,22.26 | 13.75,21.23 10.75,21.23
  Top 0.8: 13.5,24.5 13.5,22.75 13,22.75 13,24.5 12.5,24.5 12.5,22.75 12.25,22.75 12.25,24.5 | 12.25,20.75 12.25,19.25 12.75,19.25 12.75,20.75 13.25,20.75 13.25,19.25 13.75,19.25 13.75,20.75
  pour Top (no thermals): 0,0 39.75,0 39.75,36.25 0,36.25
  pour Bottom (no thermals): 0,36.25 39.75,36.25 39.75,0 0,0
IMU_SCL_1
  Top 0.3: IC7.38 20,20.75 20,21.5 16.5,21.5 I2C_PULLUP_1.1 16.5,22.76 U5.23
IMU_SDA_1
  Top 0.3: IC7.37 20.5,21.25 20.5,22 20,22 20,24.75 17.75,24.75 I2C_PULLUP_2.1 | 17.75,22.25 I2C_PULLUP_2.1 | I2C_PULLUP_2.1 17.75,23.27 U5.24
LED_RST_1_1
  Top 0.3: IC7.40 19,19.75 LED_RST_1.A
LED_RST_2_1
  Top 0.3: R_RST_LED_1.2 LED_RST_1.C
N$1
  Top 0.3: IC7.27 27,23.75 31.5,23.75 31.5,24.75 32.75,24.75 32.75,25.5 LED_STAT_1.C
N$2
  Top 0.3: LED_STAT_1.A R_STAT_LED_1.2
N$3
  Top 0.3: LED_STAT_2.A R_STAT_LED_2.2
N$4
  Top 0.3: IC7.28 26.5,24.25 30.75,24.25 30.75,25.5 LED_STAT_2.C
N$5
  Top 0.3: LED_STAT_3.A R_STAT_LED_3.2
N$6
  Top 0.3: LED_RST_4.A R_STAT_LED_4.2
N$7
  Top 0.3: IC7.30 25.5,25.5 LED_RST_4.C
N$8
  Top 0.3: IC7.29 26,24.75 29.75,24.75 LED_STAT_3.C
NRST_1
  Top 0.3: R_NRST_PU_1.2 25.5,11.75 IC7.7
PWM_1
  Top 0.3: IC7.34 23.5,25 22.75,25 22.75,28.75 26.5,28.75 26.5,31 26.75,31.25 35.5,31.25 35.5,30 | Q1.1 35.5,30 | 35.5,30 R5.2
PWM_2
  Top 0.3: IC7.35 23,24.5 22.25,24.5 22.25,26 21,26 21,26.25 20.25,26.25 20.25,27 15.8,27 Q2.1 14.25,27.75 14.25,29.25 9,29.25 R6.2
PWM_3
  Top 0.3: IC7.45 19,17.25 19,15.25 3.5,15.25 3.5,20 7.25,20 7.25,28 6.5,28 | 6.5,28 4.5,28 Q3.1 | R8.1 6.5,28
PWM_4
  Top 0.3: Q4.1 12.75,4.25 5,4.25 | 5,4.25 2.75,4.25 2.75,14.75 19.5,14.75 19.5,16.75 IC7.46 | R7.2 5,4.25
REGOUT_1
  Top 0.3: U5.10 9.25,21.72 9.25,26.5 C_IMU_FILT_1.2
V+
  Top 0.3: D3.C 3.25,23.15 JP3.1 | D2.C 12.9,33 JP2.1 | D1.C 36.25,21.65 JP11.1 | JP4.1 20,3.25 19.35,3.25 D4.C | CN2.1 R2.1 | 22.05,33 22,33
  Top 0.5: C_BYP_IN_1.1 9.06,9 REG.3 | 18.75,33 22,33 25.25,33 | CN2.1 22.05,33
  Top 0.8: 1,22.48 1,1 20,1 20,3.25 20,6.25 15.27,6.25 JP10.1 15.27,11.25 9.06,11.25 REG.3 | JP3.1 1,22.48 | 1,22.48 1,35.25 12.25,35.25 | 12.25,35.25 16.25,35.25 16.25,33 18.75,33 | 22.75,33 25.25,33 25.25,35.25 38.75,35.25 38.75,20.98 JP11.1 | 12.25,35.25 12.25,33.75 12.23,33.75 JP2.1
V-  (1 unrouted)
  Top 0.3: R7.1 5,2
  Top 0.8: R4.2 13.75,6 13.75,2.3 Q4.2 12.75,2 5,2 2,2 2,21 6.5,21 6.5,27.25 3.5,27.25 3.5,30.7 Q3.2 4.5,31.35 R8.2 R6.1 10.5,31.35 10.5,30 15,30 15,28.75 17.7,28.75 | 17.7,28.75 17.95,28.75 17.95,31 18.25,31 18.25,31.5 19.25,31.5 | Q1.2 36.5,25.3 36.5,28.5 37.5,28.5 37.5,30 R5.1 37.35,32.75 26.25,32.75 26.25,31.75 23.25,31.75 23.25,31.5 | Q2.2 17.7,28.75
ZB_AVDD1
  Top 0.3: CB1.1 29.25,8.75 RADIO1.29
ZB_BAL1_1
  Top 0.3: C_RF_CU1_1.2 35.85,3.65 BALUN1.3
ZB_BAL2_1
  Top 0.3: C_RF_CU2_1.2 30.65,3.65 BALUN1.4
ZB_DVDD1
  Top 0.3: RADIO1.14 RADIO1.13 37.5,9.25 CB3.1
ZB_IRQ_1
  Top 0.3: IC7.10 27,12.5 27.75,12.5 27.75,11.38 RADIO1.24
ZB_MISO_1
  Top 0.3: RADIO1.20 33.5,14.5 28,14.5 IC7.12
ZB_MOSI_1  (via drill 0.5)
  Top 0.3: RADIO1.22 32.5,13.5 v32.75,13.5 | IC7.13 29.5,15.5 32.75,15.5 v32.75,16.25
  Bottom 0.3: v32.75,16.25 v32.75,13.5
ZB_RFN1
  Top 0.3: RADIO1.4 33,5 C_RF_CU2_1.1
ZB_RFP1
  Top 0.3: RADIO1.5 33.5,5 C_RF_CU1_1.1
ZB_SCLK_1
  Top 0.3: RADIO1.19 34,15 28.75,15 28,15.75 27.5,15.75 IC7.11
ZB_SEL_1  (via drill 0.5)
  Top 0.3: RADIO1.23 32,12.25 31.5,12.25 v31.5,13.5 | v31.5,16.25 IC7.14
  Bottom 0.3: v31.5,13.5 v31.5,16.25

### Text on the board
tPlace: PPR | 2013.03
tValues: Y | X | - | + | FOX942B-16